# EAGLE schematic FSAE Dash v0.2 (EAGLE 7.7.0)

## Sheet 1 of 4
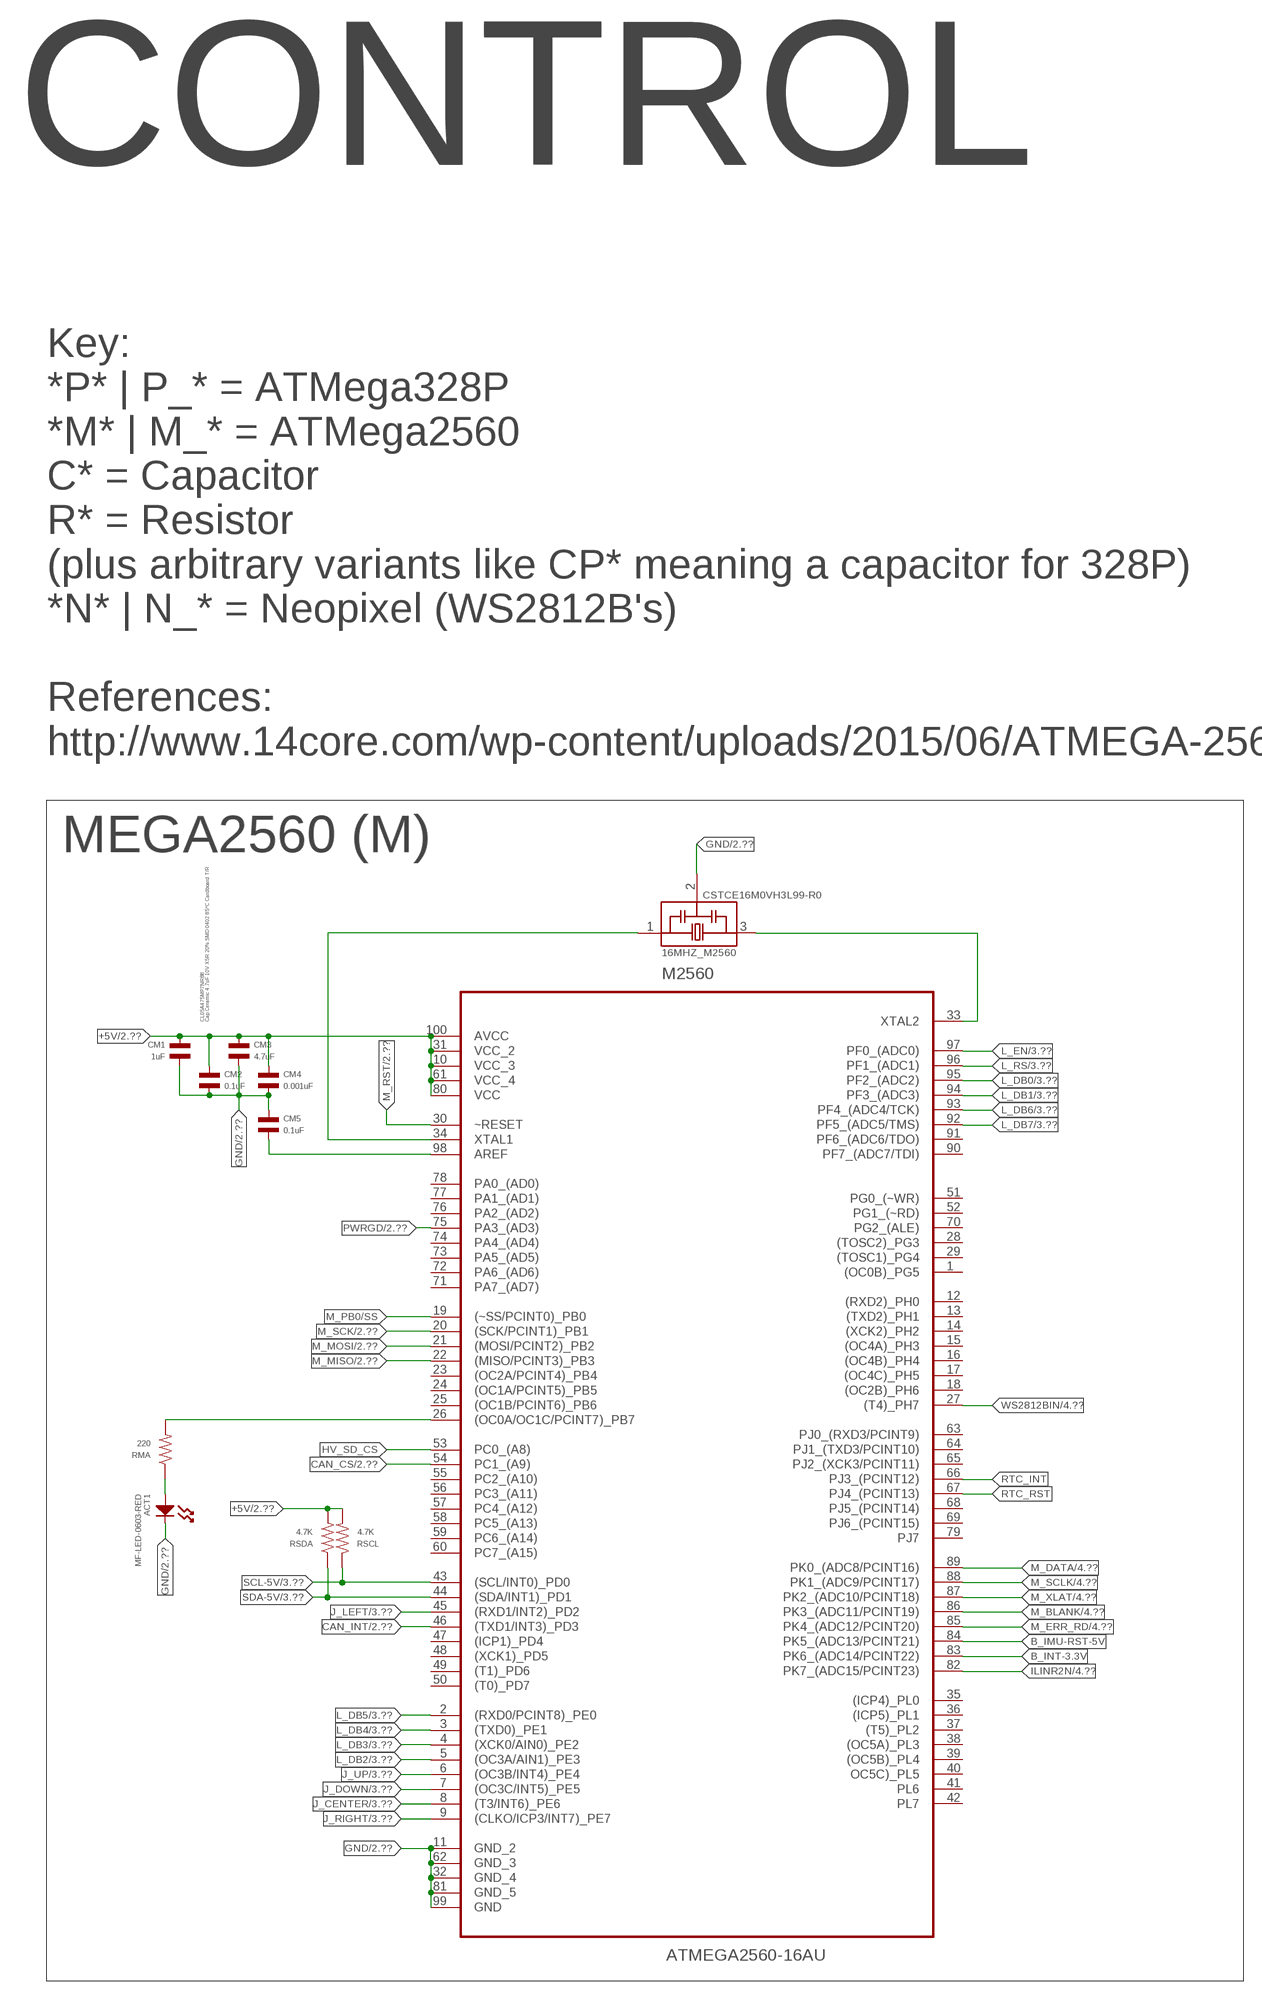
[diagram p0: schematic, sheet 1, part 1 of 2]
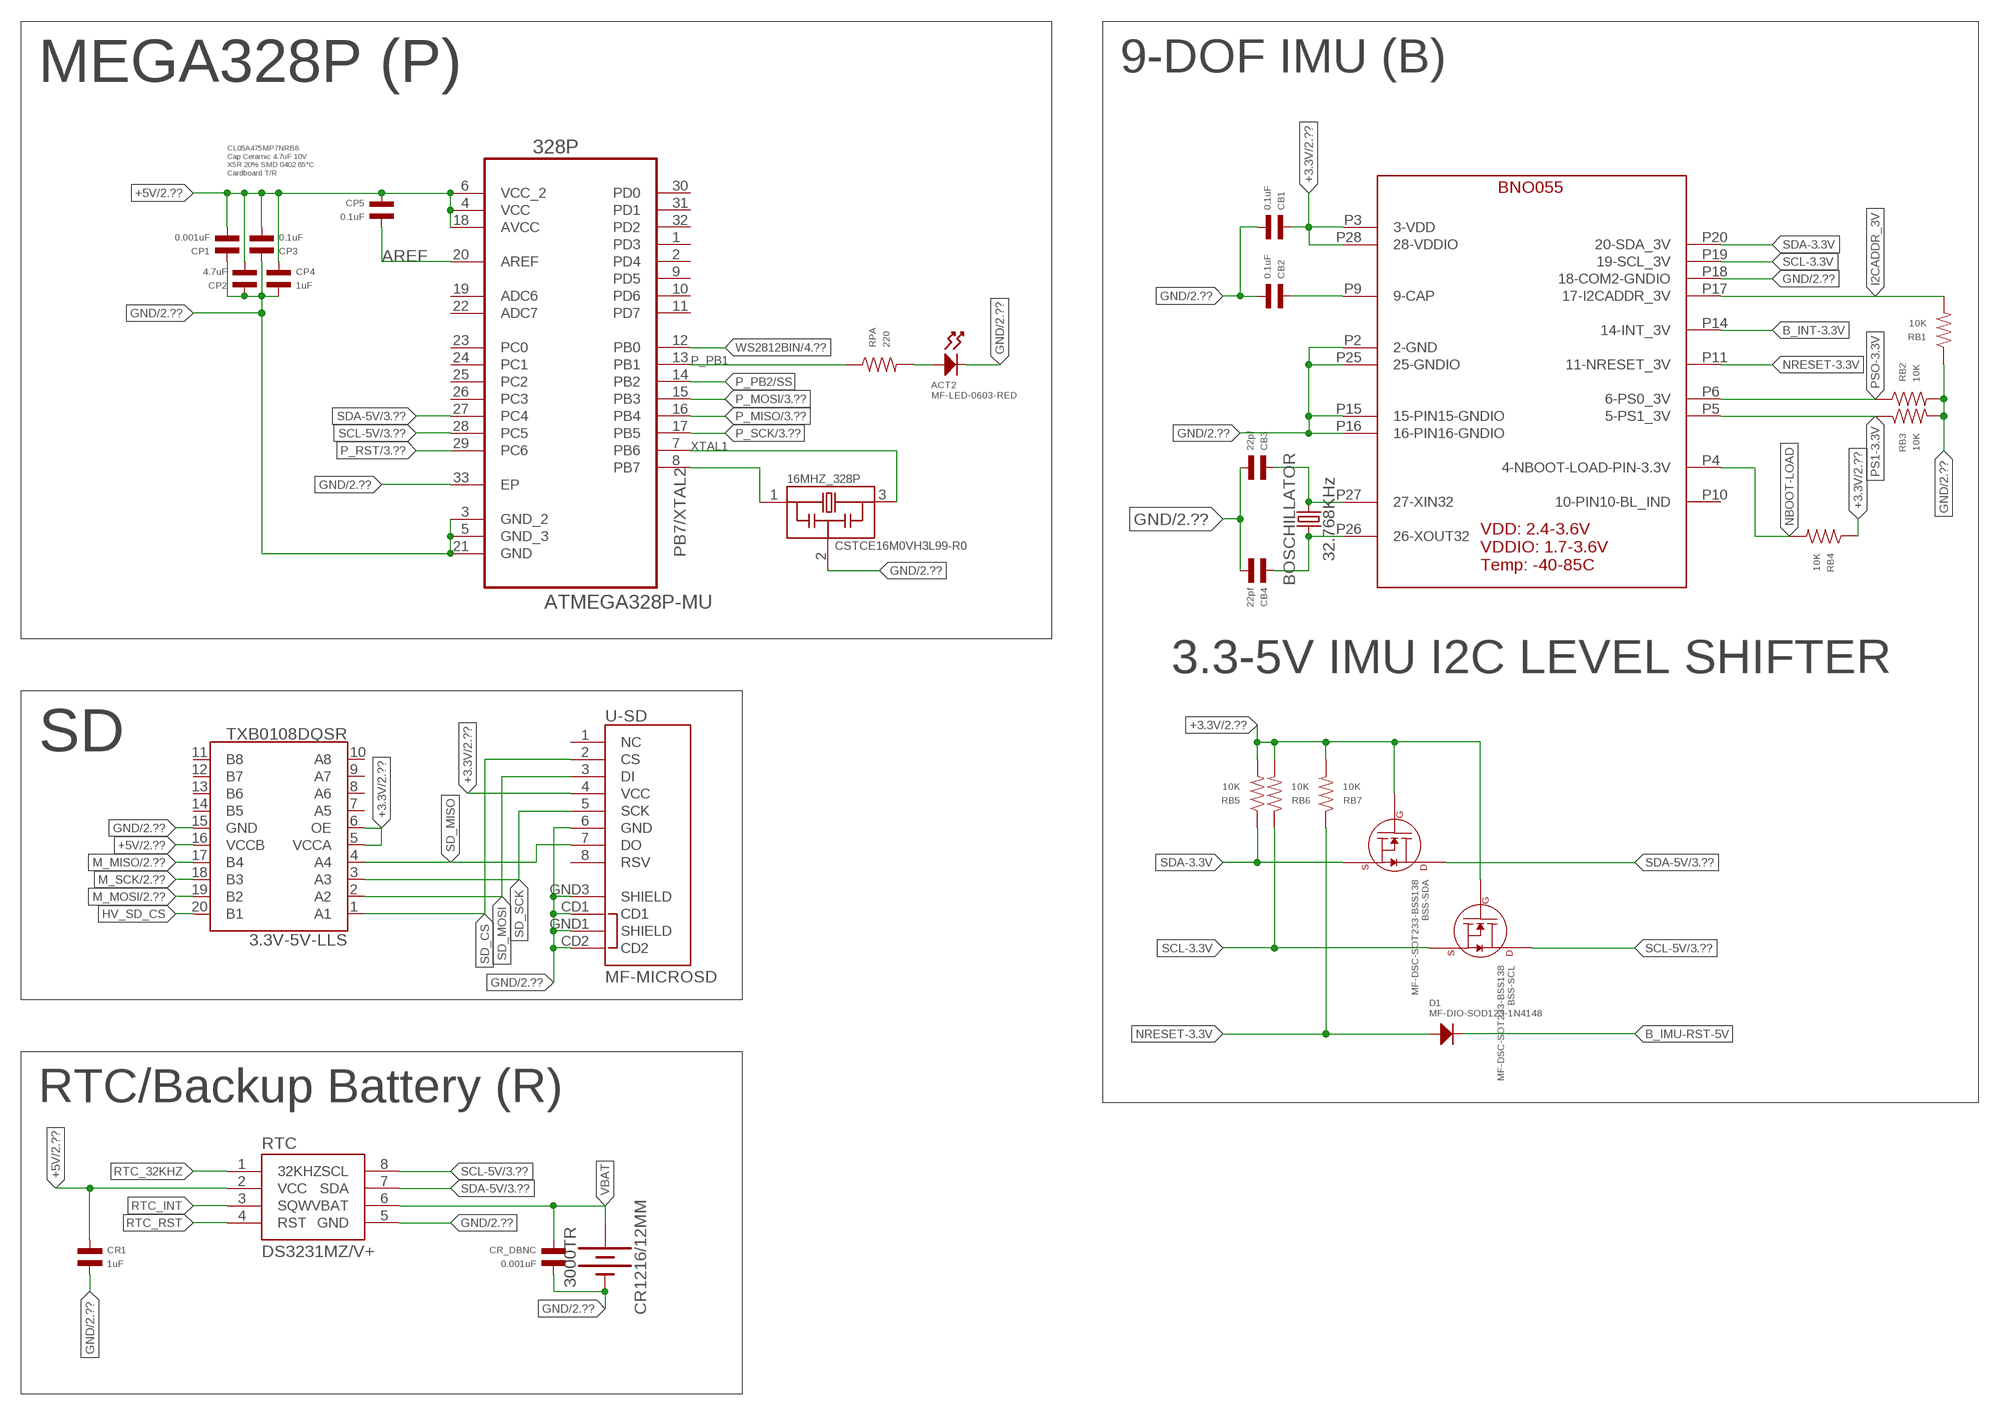
[diagram p1: schematic, sheet 1, part 2 of 2]

### Parts
3.3V-5V-LLS  TXB0108DQSR  TXB0108  [UFDFN-20]
16MHZ_328P  CSTCE16M0VH3L99-R0  CSTCE16M0V53-R0  [OSC_CSTCE16M0V53-R0]
16MHZ_M2560  CSTCE16M0VH3L99-R0  CSTCE16M0V53-R0  [OSC_CSTCE16M0V53-R0]
328P  ATMEGA328P-MU  [QFN50P500X500X100-33N]
ACT1  MF-LED-0603-RED  LED_SINGLE-0603-RED  [LED0603]
ACT2  MF-LED-0603-RED  LED_SINGLE-0603-RED  [LED0603]
BNO  BNO055  BOSCH-BNO055  [BOSCH-BNO055]
BOSCHILLATOR  32.768KHz  CRYSTALSMD-3.2X1.5  [CRYSTAL-SMD-3.2X1.5MM]
BSS-SCL  MF-DSC-SOT233-BSS138  N-CHANNEL_FET_BSS138_SOT-23-3  [SOT-23-3]
BSS-SDA  MF-DSC-SOT233-BSS138  N-CHANNEL_FET_BSS138_SOT-23-3  [SOT-23-3]
CB1  0.1uF  CAPACITOR_NP_0402  [C0402]
CB2  0.1uF  CAPACITOR_NP_0402  [C0402]
CB3  22pf  CAPACITOR_NP_0402  [C0402]
CB4  22pf  CAPACITOR_NP_0402  [C0402]
CM1  1uF  CAPACITOR_NP_0402  [C0402]
CM2  0.1uF  CAPACITOR_NP_0402  [C0402]
CM3  4.7uF  CAPACITOR_NP_0402  [C0402]
CM4  0.001uF  CAPACITOR_NP_0402  [C0402]
CM5  0.1uF  CAPACITOR_NP_0402  [C0402]
CP1  0.001uF  CAPACITOR_NP_0402  [C0402]
CP2  4.7uF  CAPACITOR_NP_0402  [C0402]
CP3  0.1uF  CAPACITOR_NP_0402  [C0402]
CP4  1uF  CAPACITOR_NP_0402  [C0402]
CP5  0.1uF  CAPACITOR_NP_0402  [C0402]
CR1  1uF  CAPACITOR_NP_0402  [C0402]
CR1216/12MM  3000TR  BATTERY-12MM_SMD  [BATTCON_12MM]
CR_DBNC  0.001uF  CAPACITOR_NP_0402  [C0402]
D1  MF-DIO-SOD123-1N4148  DIODES_1N4148_SOD-123  [SOD-123]
M2560  ATMEGA2560-16AU  [QFP50P1600X1600X120-100N]
RB1  10K  RESISTOR_0402  [R0402]
RB2  10K  RESISTOR_0402  [R0402]
RB3  10K  RESISTOR_0402  [R0402]
RB4  10K  RESISTOR_0402  [R0402]
RB5  10K  RESISTOR_0402  [R0402]
RB6  10K  RESISTOR_0402  [R0402]
RB7  10K  RESISTOR_0402  [R0402]
RMA  220  RESISTOR_0402  [R0402]
RPA  220  RESISTOR_0402  [R0402]
RSCL  4.7K  RESISTOR_0402  [R0402]
RSDA  4.7K  RESISTOR_0402  [R0402]
RTC  DS3231MZ/V+  DS3231M  [SO08]
U-SD  MF-MICROSD  USD-SOCKET  [MICROSD_1:1]

### Nets
+3.3V: 3.3V-5V-LLS.5(VCCA) 3.3V-5V-LLS.6(OE) BNO.P3(3-VDD) BNO.P28(28-VDDIO) BSS-SCL.P$1(GATE) BSS-SDA.P$1(GATE) CB1.P$1 RB4.P$1 RB5.P$2 RB6.P$2 RB7.P$2 U-SD.4(VCC) ; also sheet 2
+5V: 3.3V-5V-LLS.16(VCCB) 328P.4(VCC) 328P.6(VCC_2) 328P.18(AVCC) CM1.P$1 CM2.P$1 CM3.P$1 CM4.P$1 CP1.P$2 CP2.P$2 CP3.P$2 CP4.P$1 CP5.P$1 CR1.P$1 M2560.10(VCC_3) M2560.31(VCC_2) M2560.61(VCC_4) M2560.80(VCC) M2560.100(AVCC) RSCL.P$2 RSDA.P$2 RTC.2(VCC) ; also sheet 2,3,4
AREF: 328P.20(AREF) CP5.P$2
B_IMU-RST-5V: D1.CATHODE M2560.84(PK5_(ADC13/PCINT21))
B_INT-3.3V: BNO.P14(14-INT_3V) M2560.83(PK6_(ADC14/PCINT22))
BCAP: BNO.P9(9-CAP) CB2.P$1
CAN_CS: M2560.54(PC1_(A9)) ; also sheet 2
CAN_INT: M2560.46((TXD1/INT3)_PD3) ; also sheet 2
GND: 3.3V-5V-LLS.15(GND) 16MHZ_328P.2 16MHZ_M2560.2 328P.3(GND_2) 328P.5(GND_3) 328P.21(GND) 328P.33(EP) ACT1.CATHODE ACT2.CATHODE BNO.P2(2-GND) BNO.P15(15-PIN15-GNDIO) BNO.P16(16-PIN16-GNDIO) BNO.P18(18-COM2-GNDIO) BNO.P25(25-GNDIO) CB1.P$2 CB2.P$2 CB3.P$2 CB4.P$2 CM1.P$2 CM2.P$2 CM3.P$2 CM4.P$2 CM5.P$1 CP1.P$1 CP2.P$1 CP3.P$1 CP4.P$2 CR1.P$2 CR1216/12MM.GND(-) CR_DBNC.P$2 M2560.11(GND_2) M2560.32(GND_4) M2560.62(GND_3) M2560.81(GND_5) M2560.99(GND) RB1.P$1 RB2.P$2 RB3.P$2 RTC.5(GND) U-SD.6(GND) U-SD.CD1 U-SD.CD2 U-SD.GND1(SHIELD) U-SD.GND3(SHIELD) ; also sheet 2,3,4
HV_SD_CS [8mil]: 3.3V-5V-LLS.20(B1) M2560.53(PC0_(A8))
I2CADDR_3V: BNO.P17(17-I2CADDR_3V) RB1.P$2
ILINR2N: M2560.82(PK7_(ADC15/PCINT23)) ; also sheet 4
J_CENTER: M2560.8((T3/INT6)_PE6) ; also sheet 3
J_DOWN: M2560.7((OC3C/INT5)_PE5) ; also sheet 3
J_LEFT: M2560.45((RXD1/INT2)_PD2) ; also sheet 3
J_RIGHT: M2560.9((CLKO/ICP3/INT7)_PE7) ; also sheet 3
J_UP: M2560.6((OC3B/INT4)_PE4) ; also sheet 3
L_DB0: M2560.95(PF2_(ADC2)) ; also sheet 3
L_DB1: M2560.94(PF3_(ADC3)) ; also sheet 3
L_DB2: M2560.5((OC3A/AIN1)_PE3) ; also sheet 3
L_DB3: M2560.4((XCK0/AIN0)_PE2) ; also sheet 3
L_DB4: M2560.3((TXD0)_PE1) ; also sheet 3
L_DB5: M2560.2((RXD0/PCINT8)_PE0) ; also sheet 3
L_DB6: M2560.93(PF4_(ADC4/TCK)) ; also sheet 3
L_DB7: M2560.92(PF5_(ADC5/TMS)) ; also sheet 3
L_EN: M2560.97(PF0_(ADC0)) ; also sheet 3
L_RS: M2560.96(PF1_(ADC1)) ; also sheet 3
M_BLANK: M2560.86(PK3_(ADC11/PCINT19)) ; also sheet 4
M_DATA: M2560.89(PK0_(ADC8/PCINT16)) ; also sheet 4
M_ERR_RD: M2560.85(PK4_(ADC12/PCINT20)) ; also sheet 4
M_MISO [8mil]: 3.3V-5V-LLS.17(B4) M2560.22((MISO/PCINT3)_PB3) ; also sheet 2,3
M_MOSI [8mil]: 3.3V-5V-LLS.19(B2) M2560.21((MOSI/PCINT2)_PB2) ; also sheet 2,3
M_PB0/SS: M2560.19((~SS/PCINT0)_PB0)
M_RST: M2560.30(~RESET) ; also sheet 2,3
M_SCK [8mil]: 3.3V-5V-LLS.18(B3) M2560.20((SCK/PCINT1)_PB1) ; also sheet 2,3
M_SCLK: M2560.88(PK1_(ADC9/PCINT17)) ; also sheet 4
M_XLAT: M2560.87(PK2_(ADC10/PCINT18)) ; also sheet 4
N$21 [_12mil]: ACT2.ANODE RPA.P$2
N$23: 16MHZ_M2560.3 M2560.33(XTAL2)
N$26: CM5.P$2 M2560.98(AREF)
N$29: 16MHZ_M2560.1 M2560.34(XTAL1)
N$32: ACT1.ANODE RMA.P$1
N$34: BNO.P26(26-XOUT32) BOSCHILLATOR.P$1 CB4.P$1
N$35: BNO.P27(27-XIN32) BOSCHILLATOR.P$2 CB3.P$1
N$38: M2560.26((OC0A/OC1C/PCINT7)_PB7) RMA.P$2
NBOOT-LOAD: BNO.P4(4-NBOOT-LOAD-PIN-3.3V) RB4.P$2
NRESET-3.3V: BNO.P11(11-NRESET_3V) D1.ANODE RB7.P$1
P_MISO: 328P.16(PB4) ; also sheet 3
P_MOSI: 328P.15(PB3) ; also sheet 3
P_PB1: 328P.13(PB1) RPA.P$1
P_PB2/SS: 328P.14(PB2)
P_RST: 328P.29(PC6) ; also sheet 3
P_SCK: 328P.17(PB5) ; also sheet 3
PB7/XTAL2: 16MHZ_328P.1 328P.8(PB7)
PS1-3.3V: BNO.P5(5-PS1_3V) RB3.P$1
PSO-3.3V: BNO.P6(6-PS0_3V) RB2.P$1
PWRGD: M2560.75(PA3_(AD3)) ; also sheet 2
RTC_32KHZ: RTC.1(32KHZ)
RTC_INT: M2560.66(PJ3_(PCINT12)) RTC.3(SQW)
RTC_RST: M2560.67(PJ4_(PCINT13)) RTC.4(RST)
SCL-3.3V: BNO.P19(19-SCL_3V) BSS-SCL.P$2(SOURCE) RB6.P$1
SCL-5V: 328P.28(PC5) BSS-SCL.P$3(DRAIN) M2560.43((SCL/INT0)_PD0) RSCL.P$1 RTC.8(SCL) ; also sheet 3
SD_CS [8mil]: 3.3V-5V-LLS.1(A1) U-SD.2(CS)
SD_MISO: 3.3V-5V-LLS.4(A4) U-SD.7(DO)
SD_MOSI: 3.3V-5V-LLS.2(A2) U-SD.3(DI)
SD_SCK: 3.3V-5V-LLS.3(A3) U-SD.5(SCK)
SDA-3.3V: BNO.P20(20-SDA_3V) BSS-SDA.P$2(SOURCE) RB5.P$1
SDA-5V: 328P.27(PC4) BSS-SDA.P$3(DRAIN) M2560.44((SDA/INT1)_PD1) RSDA.P$1 RTC.7(SDA) ; also sheet 3
VBAT: CR1216/12MM.PWR@1(+) CR_DBNC.P$1 RTC.6(VBAT)
WS2812BIN: 328P.12(PB0) M2560.27((T4)_PH7) ; also sheet 4
XTAL1: 16MHZ_328P.3 328P.7(PB6)
Unconnected: 3.3V-5V-LLS.7(A5) 3.3V-5V-LLS.8(A6) 3.3V-5V-LLS.9(A7) 3.3V-5V-LLS.10(A8) 3.3V-5V-LLS.11(B8) 3.3V-5V-LLS.12(B7) 3.3V-5V-LLS.13(B6) 3.3V-5V-LLS.14(B5) 328P.1(PD3) 328P.2(PD4) 328P.9(PD5) 328P.10(PD6) 328P.11(PD7) 328P.19(ADC6) 328P.22(ADC7) 328P.23(PC0) 328P.24(PC1) 328P.25(PC2) 328P.26(PC3) 328P.30(PD0) 328P.31(PD1) 328P.32(PD2) BNO.P10(10-PIN10-BL_IND) M2560.1((OC0B)_PG5) M2560.12((RXD2)_PH0) M2560.13((TXD2)_PH1) M2560.14((XCK2)_PH2) M2560.15((OC4A)_PH3) M2560.16((OC4B)_PH4) M2560.17((OC4C)_PH5) M2560.18((OC2B)_PH6) M2560.23((OC2A/PCINT4)_PB4) M2560.24((OC1A/PCINT5)_PB5) M2560.25((OC1B/PCINT6)_PB6) M2560.28((TOSC2)_PG3) M2560.29((TOSC1)_PG4) M2560.35((ICP4)_PL0) M2560.36((ICP5)_PL1) M2560.37((T5)_PL2) M2560.38((OC5A)_PL3) M2560.39((OC5B)_PL4) M2560.40(OC5C)_PL5) M2560.41(PL6) M2560.42(PL7) M2560.47((ICP1)_PD4) M2560.48((XCK1)_PD5) M2560.49((T1)_PD6) M2560.50((T0)_PD7) M2560.51(PG0_(~WR)) M2560.52(PG1_(~RD)) M2560.55(PC2_(A10)) M2560.56(PC3_(A11)) M2560.57(PC4_(A12)) M2560.58(PC5_(A13)) M2560.59(PC6_(A14)) M2560.60(PC7_(A15)) M2560.63(PJ0_(RXD3/PCINT9)) M2560.64(PJ1_(TXD3/PCINT10)) M2560.65(PJ2_(XCK3/PCINT11)) M2560.68(PJ5_(PCINT14)) M2560.69(PJ6_(PCINT15)) M2560.70(PG2_(ALE)) M2560.71(PA7_(AD7)) M2560.72(PA6_(AD6)) M2560.73(PA5_(AD5)) M2560.74(PA4_(AD4)) M2560.76(PA2_(AD2)) M2560.77(PA1_(AD1)) M2560.78(PA0_(AD0)) M2560.79(PJ7) M2560.90(PF7_(ADC7/TDI)) M2560.91(PF6_(ADC6/TDO)) U-SD.1(NC) U-SD.8(RSV)

### Notes on the sheet
- CONTROL
- NOTES:
  The original boards were manufactured using MacroFab's standard 4-layer turnkey process. 
  If needed, my own library has been included.
  
  Objects beginning with "MF" are from the MacroFab Eagle library, available on Github, along with the relevant DRC.
  MacroFab has a relatively long lead time (~1mo) and occasionally makes mistakes, 
  so budget in some ChipQuik and don't procrastinate with orders. 
  MacroFab's system pulls model numbers from the Eagle "value" field, 
  so if you're not sure what something here is, see if there's not something in it.
  
  Special thanks to SparkFun and Adafruit OSHW designs, on which parts of this are based. 
  
  Also FYI: WS2812B's (the LED's) have an equivalent Moisture Sensitivity Level 6! 
  Using them in a reflow oven without using desiccants and baking them before use will lead to cracked epoxy lenses! 
  Resoldering them by hand was not fun. 
  (The next versions will use the newer variants with redundant data lines as an extra precaution.)
  
  Clinton Flowers, 2017-7-01
  clintonflowers222@gmail.com
  Kennesaw State University Motorsports
- Key:
  *P* | P_* = ATMega328P
  *M* | M_* = ATMega2560
  C* = Capacitor
  R* = Resistor
  (plus arbitrary variants like CP* meaning a capacitor for 328P)
  *N* | N_* = Neopixel (WS2812B's)
  
  References:
  http://www.14core.com/wp-content/uploads/2015/06/ATMEGA-2560-Pin-Out-Diagram.png
- MEGA2560 (M) | MEGA328P (P) | 9-DOF IMU (B)
- CL05A475MP7NRB8
  Cap Ceramic 4.7uF 10V 
  X5R 20% SMD 0402 85°C 
  Cardboard T/R
- CL05A475MP7NRB8
  Cap Ceramic 4.7uF 10V X5R 20% SMD 0402 85°C Cardboard T/R
- 3.3-5V IMU I2C LEVEL SHIFTER
- SD
- RTC/Backup Battery (R)

## Sheet 2 of 4
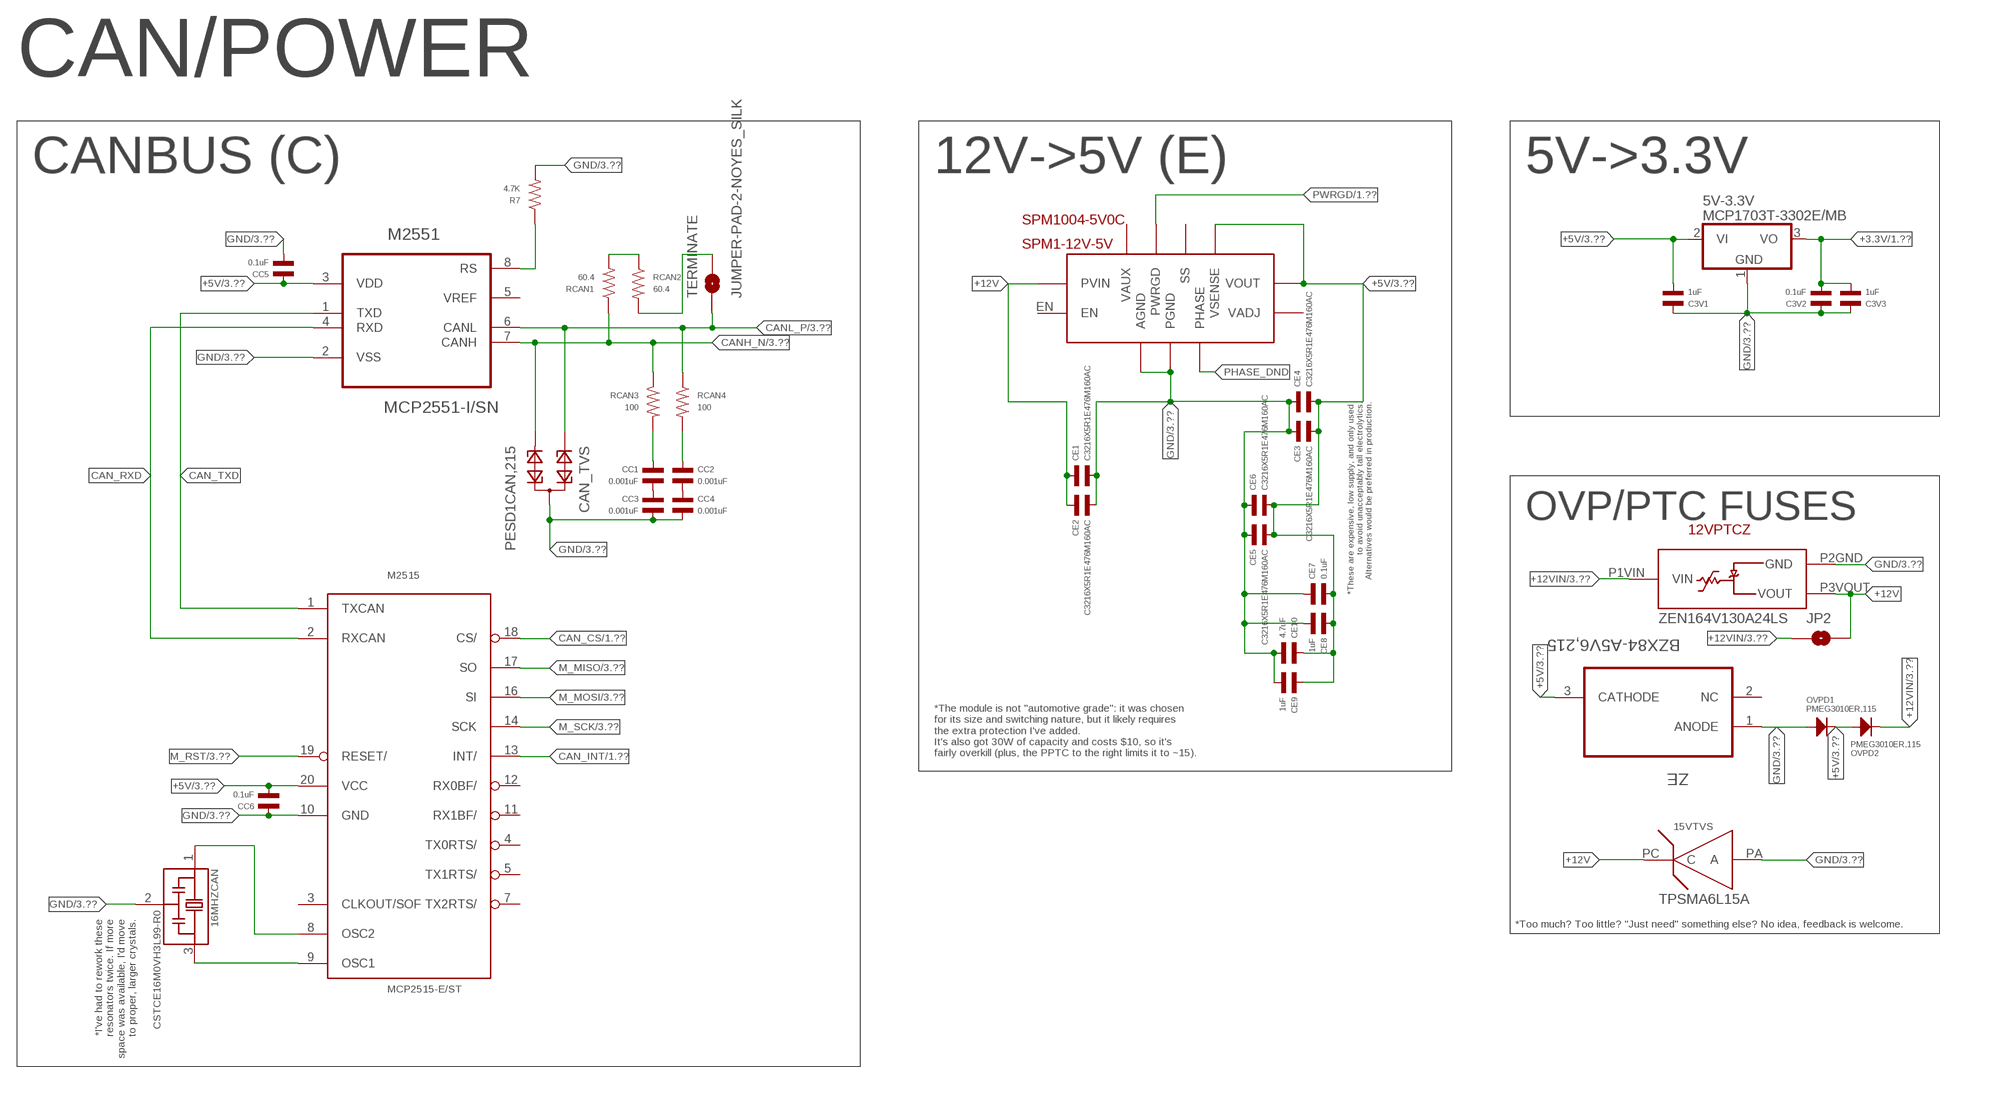
[diagram p2: schematic, sheet 2]

### Parts
5V-3.3V  MCP1703T-3302E/MB  MCP170333MB  [SOT89]
12VPTCZ  ZEN164V130A24LS  LITTELFUSE-POLYZEN-ZEN164V130A24LS  [LITTELFUSE-POLYZEN-ZEN164V130A24LS]
15VTVS  TPSMA6L15A  LITTELFUSE-TPSMA6L15A  [LITTELFUSE-TPSMA6L15A]
16MHZCAN  CSTCE16M0VH3L99-R0  CSTCE16M0V53-R0  [OSC_CSTCE16M0V53-R0]
C3V1  1uF  CAPACITOR_NP_0402  [C0402]
C3V2  0.1uF  CAPACITOR_NP_0402  [C0402]
C3V3  1uF  CAPACITOR_NP_0402  [C0402]
CAN_TVS  PESD1CAN,215  PESD1CAN  [SOT23]
CC1  0.001uF  CAPACITOR_NP_0402  [C0402]
CC2  0.001uF  CAPACITOR_NP_0402  [C0402]
CC3  0.001uF  CAPACITOR_NP_0402  [C0402]
CC4  0.001uF  CAPACITOR_NP_0402  [C0402]
CC5  0.1uF  CAPACITOR_NP_0402  [C0402]
CC6  0.1uF  CAPACITOR_NP_0402  [C0402]
CE1  C3216X5R1E476M160AC  CAPACITOR_NP_1206  [C1206]
CE2  C3216X5R1E476M160AC  CAPACITOR_NP_1206  [C1206]
CE3  C3216X5R1E476M160AC  CAPACITOR_NP_1206  [C1206]
CE4  C3216X5R1E476M160AC  CAPACITOR_NP_1206  [C1206]
CE5  C3216X5R1E476M160AC  CAPACITOR_NP_1206  [C1206]
CE6  C3216X5R1E476M160AC  CAPACITOR_NP_1206  [C1206]
CE7  0.1uF  CAPACITOR_NP_0402  [C0402]
CE8  1uF  CAPACITOR_NP_0402  [C0402]
CE9  1uF  CAPACITOR_NP_0402  [C0402]
CE10  4.7uF  CAPACITOR_NP_0402  [C0402]
JP2  JUMPER-SMT_2_NO_SILK  [SMT-JUMPER_2_NO_SILK]
M2515  MCP2515-E/ST  MCP2515TSOP  [TSSOP20]
M2551  MCP2551-I/SN  [SOIC127P600X175-8N]
OVPD1  PMEG3010ER,115  DIODES_SOD-123  [SOD-123]
OVPD2  PMEG3010ER,115  DIODES_SOD-123  [SOD-123]
R7  4.7K  RESISTOR_0402  [R0402]
RCAN1  60.4  RESISTOR_0402  [R0402]
RCAN2  60.4  RESISTOR_0402  [R0402]
RCAN3  100  RESISTOR_0402  [R0402]
RCAN4  100  RESISTOR_0402  [R0402]
SPM1-12V-5V  SPM1004-5V0C  [SPM1004-5V0C]
TERMINATE  JUMPER-PAD-2-NOYES_SILK  [PAD-JUMPER-2-NO_YES_SILK]
ZE  BZX84-A5V6,215  BZX84C5V6  [SOT91P240X110-3N]

### Nets
+3.3V: 5V-3.3V.3(VO) C3V2.P$2 C3V3.P$2 ; also sheet 1
+5V: 5V-3.3V.2(VI) 5V-3.3V.2@1(VI1) C3V1.P$2 CC5.P$1 CC6.P$2 CE3.P$2 CE4.P$2 CE5.P$2 CE6.P$2 CE7.P$2 CE8.P$1 CE9.P$1 CE10.P$1 M2515.20(VCC) M2551.3(VDD) OVPD1.CATHODE OVPD2.ANODE SPM1-12V-5V.VOUT$1(VOUT) SPM1-12V-5V.VOUT$2(VOUT) SPM1-12V-5V.VOUT$3(VOUT) SPM1-12V-5V.VOUT$4(VOUT) SPM1-12V-5V.VOUT$5(VOUT) SPM1-12V-5V.VOUT$6(VOUT) SPM1-12V-5V.VOUT$7(VOUT) SPM1-12V-5V.VOUT$8(VOUT) SPM1-12V-5V.VOUT$9(VOUT) SPM1-12V-5V.VOUT$10(VOUT) SPM1-12V-5V.VOUT$11(VOUT) SPM1-12V-5V.VOUT$12(VOUT) SPM1-12V-5V.VOUT$13(VOUT) SPM1-12V-5V.VOUT$14(VOUT) SPM1-12V-5V.VOUT$15(VOUT) SPM1-12V-5V.VOUT$16(VOUT) SPM1-12V-5V.VOUT$17(VOUT) SPM1-12V-5V.VOUT$18(VOUT) SPM1-12V-5V.VSENSE ZE.3(CATHODE) ; also sheet 1,3,4
+12V [_25mil]: 12VPTCZ.P3VOUT(VOUT) 15VTVS.PC(C) CE1.P$1 CE2.P$1 JP2.2 SPM1-12V-5V.PVIN$1(PVIN) SPM1-12V-5V.PVIN$2(PVIN) SPM1-12V-5V.PVIN$3(PVIN) SPM1-12V-5V.PVIN$4(PVIN) SPM1-12V-5V.PVIN$5(PVIN) SPM1-12V-5V.PVIN$6(PVIN) SPM1-12V-5V.PVIN$7(PVIN) SPM1-12V-5V.PVIN$8(PVIN)
+12VIN [_25mil]: 12VPTCZ.P1VIN(VIN) JP2.1 OVPD2.CATHODE ; also sheet 3
CAN_CS: M2515.18(CS/) ; also sheet 1
CAN_INT: M2515.13(INT/) ; also sheet 1
CAN_RXD: M2515.2(RXCAN) M2551.4(RXD)
CAN_TXD: M2515.1(TXCAN) M2551.1(TXD)
CANH_N [8mil]: CAN_TVS.2 M2551.7(CANH) RCAN1.P$1 RCAN3.P$1 ; also sheet 3
CANL_P [8mil]: CAN_TVS.1 M2551.6(CANL) RCAN4.P$1 TERMINATE.1 ; also sheet 3
GND: 5V-3.3V.1(GND) 12VPTCZ.P2GND(GND) 15VTVS.PA(A) 16MHZCAN.2 C3V1.P$1 C3V2.P$1 C3V3.P$1 CAN_TVS.3 CC3.P$2 CC4.P$2 CC5.P$2 CC6.P$1 CE1.P$2 CE2.P$2 CE3.P$1 CE4.P$1 CE5.P$1 CE6.P$1 CE7.P$1 CE8.P$2 CE9.P$2 CE10.P$2 M2515.10(GND) M2551.2(VSS) OVPD1.ANODE R7.P$2 SPM1-12V-5V.AGND$1(AGND) SPM1-12V-5V.AGND$2(AGND) SPM1-12V-5V.AGND$3(AGND) SPM1-12V-5V.PGND$1(PGND) SPM1-12V-5V.PGND$2(PGND) SPM1-12V-5V.PGND$3(PGND) SPM1-12V-5V.PGND$4(PGND) SPM1-12V-5V.PGND$5(PGND) SPM1-12V-5V.PGND$6(PGND) SPM1-12V-5V.PGND$7(PGND) SPM1-12V-5V.PGND$8(PGND) SPM1-12V-5V.PGND$9(PGND) SPM1-12V-5V.PGND$10(PGND) SPM1-12V-5V.PGND$11(PGND) SPM1-12V-5V.PGND$12(PGND) SPM1-12V-5V.PGND$13(PGND) SPM1-12V-5V.PGND$14(PGND) SPM1-12V-5V.PGND$15(PGND) SPM1-12V-5V.PGND$16(PGND) SPM1-12V-5V.PGND$17(PGND) SPM1-12V-5V.PGND$18(PGND) SPM1-12V-5V.PGND$19(PGND) SPM1-12V-5V.PGND$20(PGND) SPM1-12V-5V.PGND$21(PGND) SPM1-12V-5V.PGND$22(PGND) SPM1-12V-5V.PGND$23(PGND) SPM1-12V-5V.PGND$24(PGND) SPM1-12V-5V.PGND$25(PGND) SPM1-12V-5V.PGND$26(PGND) SPM1-12V-5V.PGND$27(PGND) SPM1-12V-5V.PGND$28(PGND) SPM1-12V-5V.PGND$29(PGND) SPM1-12V-5V.PGND$30(PGND) SPM1-12V-5V.PGND$31(PGND) SPM1-12V-5V.PGND$32(PGND) SPM1-12V-5V.PGND$33(PGND) SPM1-12V-5V.PGND$34(PGND) ZE.1(ANODE) ; also sheet 1,3,4
M_MISO [8mil]: M2515.17(SO) ; also sheet 1,3
M_MOSI [8mil]: M2515.16(SI) ; also sheet 1,3
M_RST: M2515.19(RESET/) ; also sheet 1,3
M_SCK [8mil]: M2515.14(SCK) ; also sheet 1,3
N$10: CC2.P$2 CC4.P$1
N$24: CC1.P$2 CC3.P$1
N$25: M2551.8(RS) R7.P$1
N$27: 16MHZCAN.1 M2515.8(OSC2)
N$28: 16MHZCAN.3 M2515.9(OSC1)
N$39: RCAN1.P$2 RCAN2.P$1
N$42: CC1.P$1 RCAN3.P$2
N$43: CC2.P$1 RCAN4.P$2
N$95: RCAN2.P$2 TERMINATE.2
PHASE_DND: SPM1-12V-5V.PHASE$1(PHASE) SPM1-12V-5V.PHASE$2(PHASE) SPM1-12V-5V.PHASE$3(PHASE)
PWRGD: SPM1-12V-5V.PWRGD ; also sheet 1
Unconnected: M2515.3(CLKOUT/SOF) M2515.4(TX0RTS/) M2515.5(TX1RTS/) M2515.7(TX2RTS/) M2515.11(RX1BF/) M2515.12(RX0BF/) M2551.5(VREF) SPM1-12V-5V.EN SPM1-12V-5V.SS SPM1-12V-5V.VADJ SPM1-12V-5V.VAUX$1(VAUX) SPM1-12V-5V.VAUX$2(VAUX) ZE.2(NC)

### Notes on the sheet
- CAN/POWER
- CANBUS (C) | 12V->5V (E) | 5V->3.3V
- *These are expensive, low supply, and only used 
  to avoid unacceptably tall electrolytics.
  Alternatives would be preferred in production.
- OVP/PTC FUSES
- ZEN164V130A24LS
- *The module is not "automotive grade": it was chosen
  for its size and switching nature, but it likely requires
  the extra protection I've added.
  It's also got 30W of capacity and costs $10, so it's
  fairly overkill (plus, the PPTC to the right limits it to ~15).
- TPSMA6L15A
- *I've had to rework these
  resonators twice. If more
  space was available, I'd move
  to proper, larger crystals.
- *Too much? Too little? "Just need" something else? No idea, feedback is welcome.

## Sheet 3 of 4
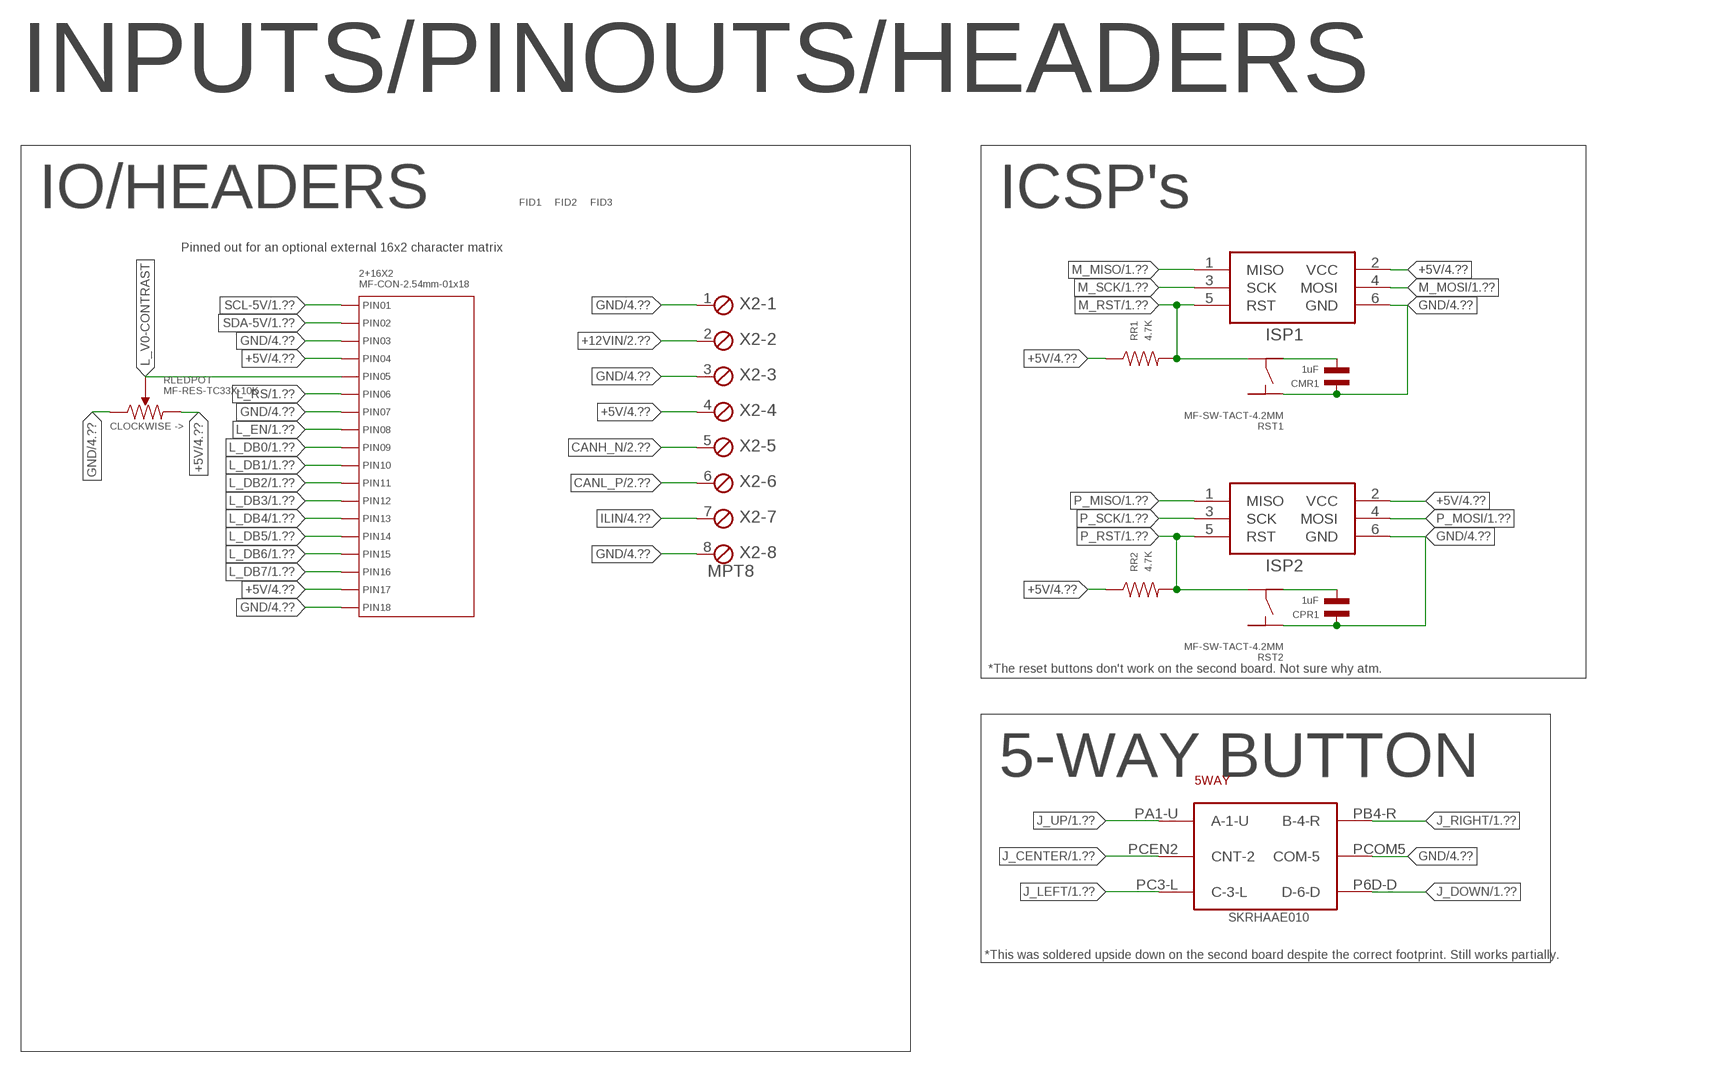
[diagram p3: schematic, sheet 3]

### Parts
2+16X2  MF-CON-2.54mm-01x18  CON_01X18_PTH_2.54MM  [PTH_2.54MM_01X18]
5WAY  SKRHAAE010  ALPS-SKRHAAE010  [ALPS-SKRHAAE010]
CMR1  1uF  CAPACITOR_NP_0402  [C0402]
CPR1  1uF  CAPACITOR_NP_0402  [C0402]
FID1  FIDUCIAL_100MIL  [FIDUCIAL_100MIL]
FID2  FIDUCIAL_100MIL  [FIDUCIAL_100MIL]
FID3  FIDUCIAL_100MIL  [FIDUCIAL_100MIL]
ISP1  AVRISP-6  [AVRISP]
ISP2  AVRISP-6  [AVRISP]
RLEDPOT  MF-RES-TC33X-10K  POTENTIOMETER_10K_TC33  [TC33]
RR1  4.7K  RESISTOR_0603  [R0603]
RR2  4.7K  RESISTOR_0603  [R0603]
RST1  MF-SW-TACT-4.2MM  TACT_4.2MM  [TACT4.2MM]
RST2  MF-SW-TACT-4.2MM  TACT_4.2MM  [TACT4.2MM]
X2  MPT8  [8POL254]

### Nets
+5V: 2+16X2.P$4(PIN4) 2+16X2.P$17(PIN17) ISP1.2(VCC) ISP2.2(VCC) RLEDPOT.P$3 RR1.P$1 RR2.P$1 X2.4 ; also sheet 1,2,4
+12VIN [_25mil]: X2.2 ; also sheet 2
CANH_N [8mil]: X2.5 ; also sheet 2
CANL_P [8mil]: X2.6 ; also sheet 2
GND: 2+16X2.P$3(PIN3) 2+16X2.P$7(PIN7) 2+16X2.P$18(PIN18) 5WAY.PCOM5(COM-5) CMR1.P$1 CPR1.P$1 ISP1.6(GND) ISP2.6(GND) RLEDPOT.P$1 RST1.P$1 RST2.P$1 X2.1 X2.3 X2.8 ; also sheet 1,2,4
ILIN: X2.7 ; also sheet 4
J_CENTER: 5WAY.PCEN2(CNT-2) ; also sheet 1
J_DOWN: 5WAY.P6D-D(D-6-D) ; also sheet 1
J_LEFT: 5WAY.PC3-L(C-3-L) ; also sheet 1
J_RIGHT: 5WAY.PB4-R(B-4-R) ; also sheet 1
J_UP: 5WAY.PA1-U(A-1-U) ; also sheet 1
L_DB0: 2+16X2.P$9(PIN9) ; also sheet 1
L_DB1: 2+16X2.P$10(PIN10) ; also sheet 1
L_DB2: 2+16X2.P$11(PIN11) ; also sheet 1
L_DB3: 2+16X2.P$12(PIN12) ; also sheet 1
L_DB4: 2+16X2.P$13(PIN13) ; also sheet 1
L_DB5: 2+16X2.P$14(PIN14) ; also sheet 1
L_DB6: 2+16X2.P$15(PIN15) ; also sheet 1
L_DB7: 2+16X2.P$16(PIN16) ; also sheet 1
L_EN: 2+16X2.P$8(PIN8) ; also sheet 1
L_RS: 2+16X2.P$6(PIN6) ; also sheet 1
L_V0-CONTRAST: 2+16X2.P$5(PIN5) RLEDPOT.P$2
M_MISO [8mil]: ISP1.1(MISO) ; also sheet 1,2
M_MOSI [8mil]: ISP1.4(MOSI) ; also sheet 1,2
M_RST: ISP1.5(RST) RR1.P$2 RST1.P$4 ; also sheet 1,2
M_SCK [8mil]: ISP1.3(SCK) ; also sheet 1,2
N$31: CPR1.P$2 RST2.P$3
N$33: CMR1.P$2 RST1.P$3
P_MISO: ISP2.1(MISO) ; also sheet 1
P_MOSI: ISP2.4(MOSI) ; also sheet 1
P_RST: ISP2.5(RST) RR2.P$2 RST2.P$4 ; also sheet 1
P_SCK: ISP2.3(SCK) ; also sheet 1
SCL-5V: 2+16X2.P$1(PIN1) ; also sheet 1
SDA-5V: 2+16X2.P$2(PIN2) ; also sheet 1
Unconnected: RST1.P$2 RST2.P$2

### Notes on the sheet
- INPUTS/PINOUTS/HEADERS
- IO/HEADERS | ICSP's
- Pinned out for an optional external 16x2 character matrix
- *The reset buttons don't work on the second board. Not sure why atm.
- 5-WAY BUTTON
- SKRHAAE010
- *This was soldered upside down on the second board despite the correct footprint. Still works partially.

## Sheet 4 of 4
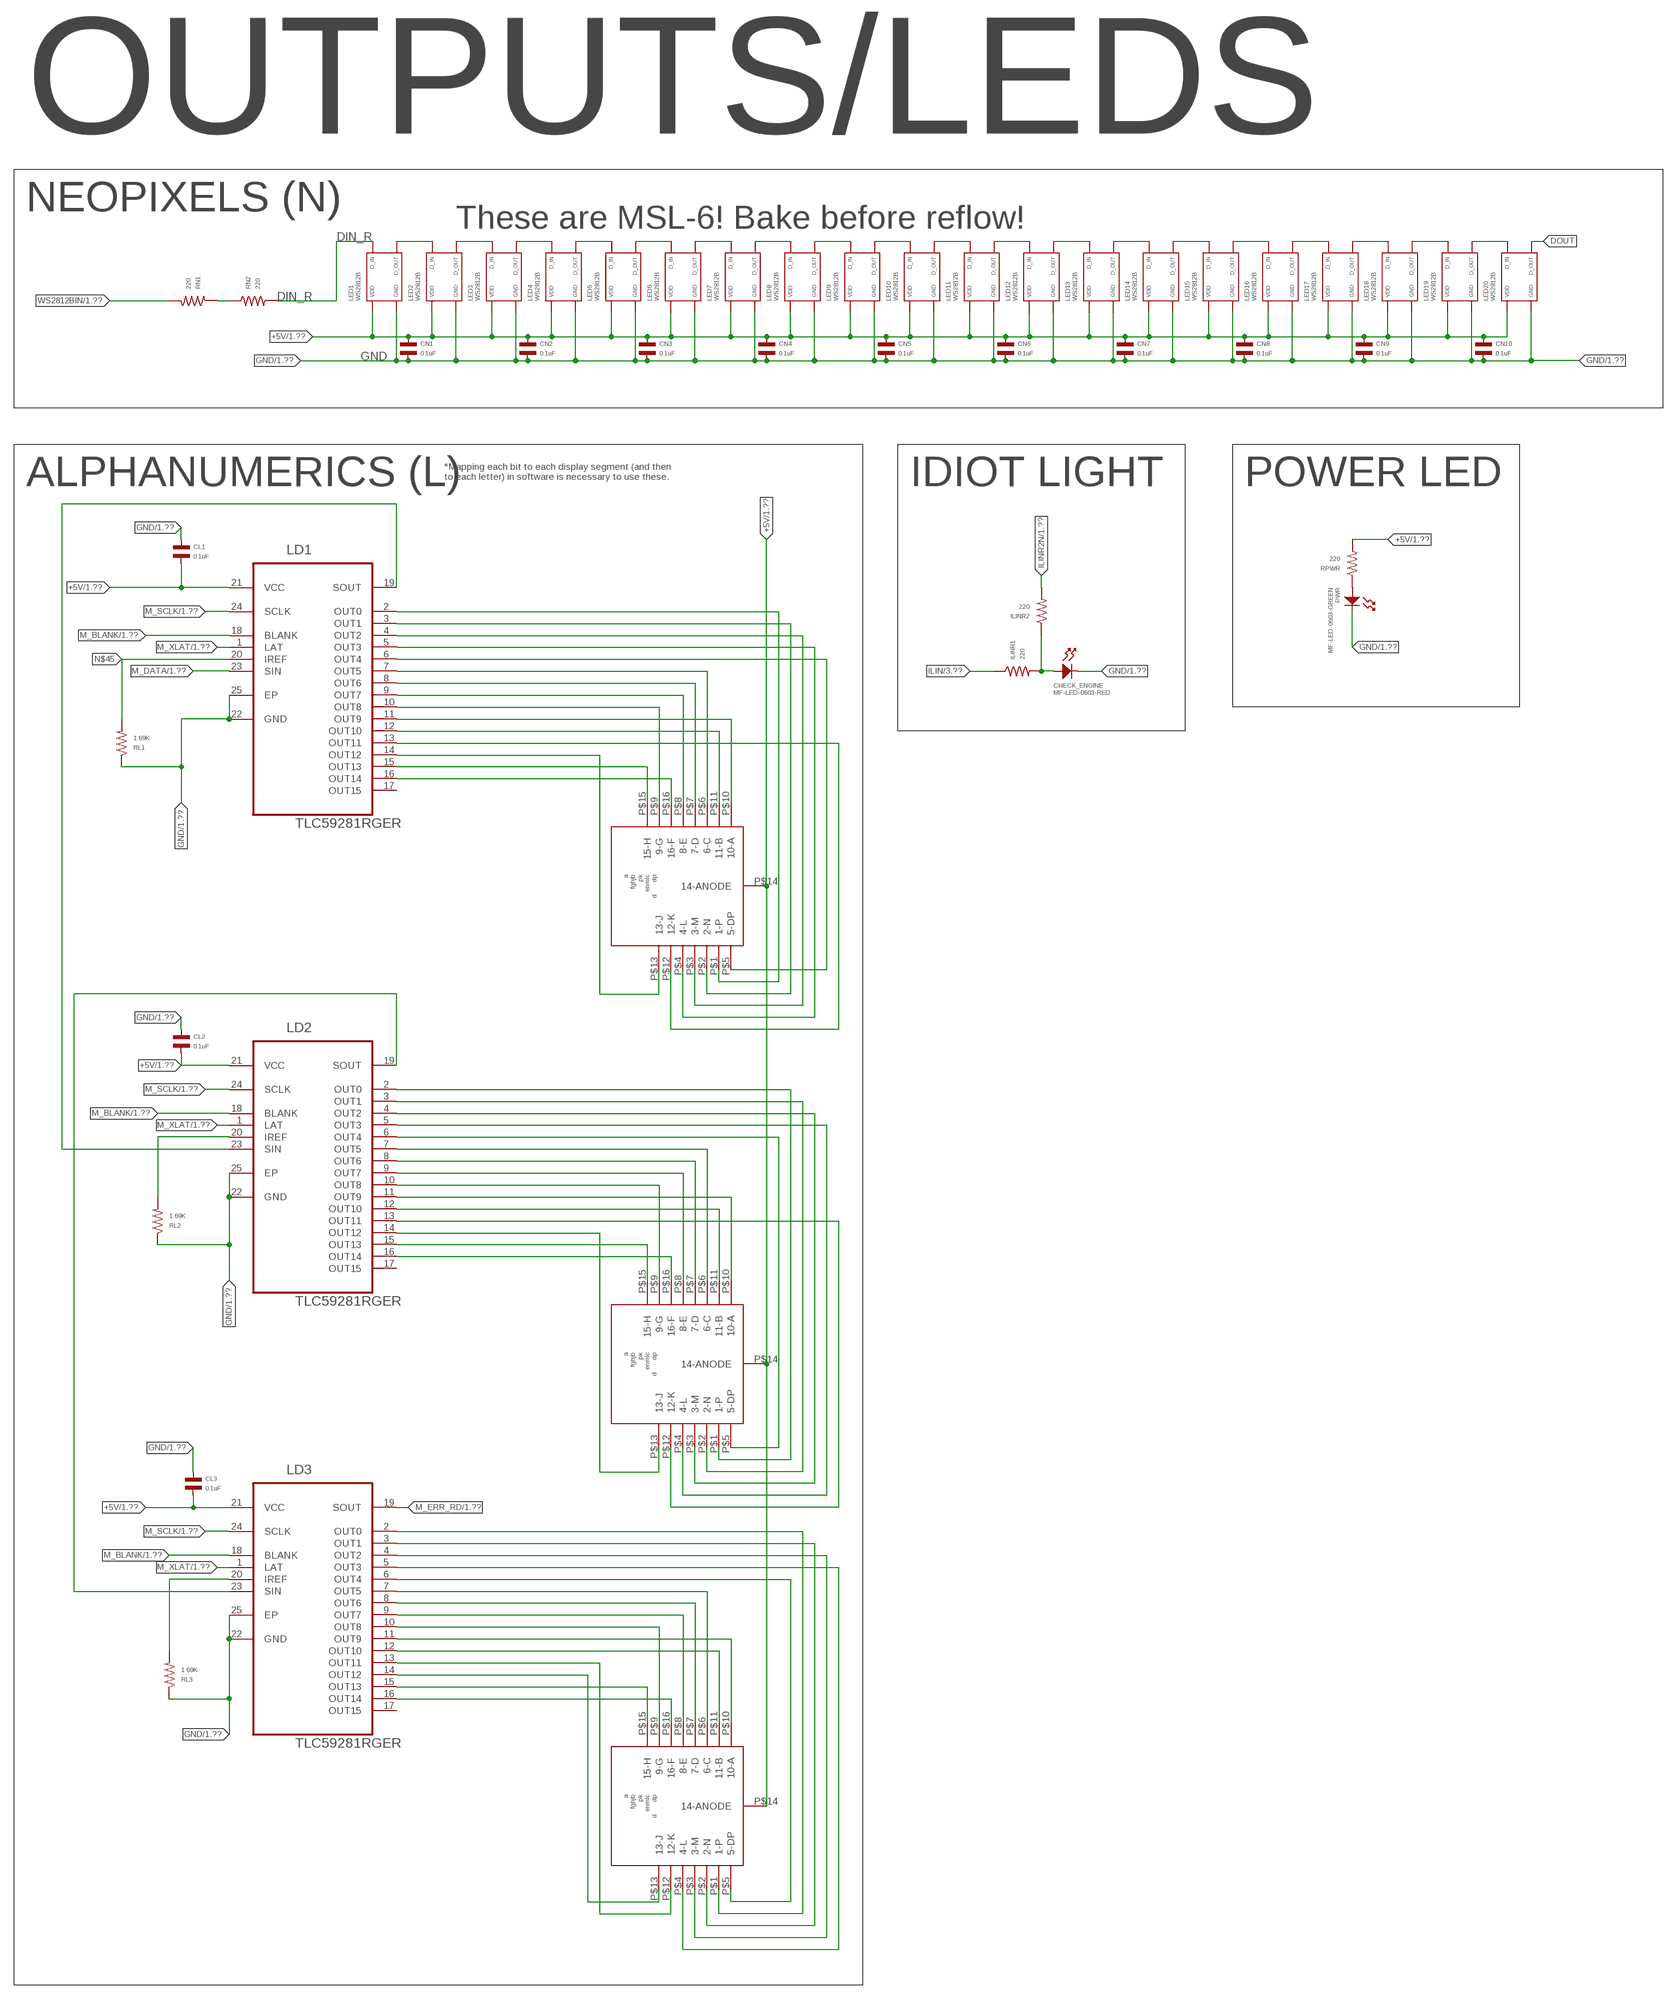
[diagram p4: schematic, sheet 4]

### Parts
CHECK_ENGINE  MF-LED-0603-RED  LED_SINGLE-0603-RED  [LED0603]
CL1  0.1uF  CAPACITOR_NP_0402  [C0402]
CL2  0.1uF  CAPACITOR_NP_0402  [C0402]
CL3  0.1uF  CAPACITOR_NP_0402  [C0402]
CN1  0.1uF  CAPACITOR_NP_0402  [C0402]
CN2  0.1uF  CAPACITOR_NP_0402  [C0402]
CN3  0.1uF  CAPACITOR_NP_0402  [C0402]
CN4  0.1uF  CAPACITOR_NP_0402  [C0402]
CN5  0.1uF  CAPACITOR_NP_0402  [C0402]
CN6  0.1uF  CAPACITOR_NP_0402  [C0402]
CN7  0.1uF  CAPACITOR_NP_0402  [C0402]
CN8  0.1uF  CAPACITOR_NP_0402  [C0402]
CN9  0.1uF  CAPACITOR_NP_0402  [C0402]
CN10  0.1uF  CAPACITOR_NP_0402  [C0402]
ILINR1  220  RESISTOR_0402  [R0402]
ILINR2  220  RESISTOR_0402  [R0402]
L1  ACPSA04-41SYKWA  [ACPSA04-41SYKWA]
L2  ACPSA04-41SYKWA  [ACPSA04-41SYKWA]
L3  ACPSA04-41SYKWA  [ACPSA04-41SYKWA]
LD1  TLC59281RGER  [QFN50P400X400X100-25N]
LD2  TLC59281RGER  [QFN50P400X400X100-25N]
LD3  TLC59281RGER  [QFN50P400X400X100-25N]
LED1  WS2812B  [WS2812B]
LED2  WS2812B  [WS2812B]
LED3  WS2812B  [WS2812B]
LED4  WS2812B  [WS2812B]
LED5  WS2812B  [WS2812B]
LED6  WS2812B  [WS2812B]
LED7  WS2812B  [WS2812B]
LED8  WS2812B  [WS2812B]
LED9  WS2812B  [WS2812B]
LED10  WS2812B  [WS2812B]
LED11  WS2812B  [WS2812B]
LED12  WS2812B  [WS2812B]
LED13  WS2812B  [WS2812B]
LED14  WS2812B  [WS2812B]
LED15  WS2812B  [WS2812B]
LED16  WS2812B  [WS2812B]
LED17  WS2812B  [WS2812B]
LED18  WS2812B  [WS2812B]
LED19  WS2812B  [WS2812B]
LED20  WS2812B  [WS2812B]
PWR  MF-LED-0603-GREEN  LED_SINGLE-0603-GREEN  [LED0603]
RL1  1.69K  RESISTOR_0603  [R0603]
RL2  1.69K  RESISTOR_0603  [R0603]
RL3  1.69K  RESISTOR_0603  [R0603]
RN1  220  RESISTOR_0402  [R0402]
RN2  220  RESISTOR_0402  [R0402]
RPWR  220  RESISTOR_0402  [R0402]

### Nets
+5V: CL1.P$2 CL2.P$2 CL3.P$2 CN1.P$1 CN2.P$1 CN3.P$1 CN4.P$1 CN5.P$1 CN6.P$1 CN7.P$1 CN8.P$1 CN9.P$1 CN10.P$1 L1.P$14(14-ANODE) L2.P$14(14-ANODE) L3.P$14(14-ANODE) LD1.21(VCC) LD2.21(VCC) LD3.21(VCC) LED1.P$1(VDD) LED2.P$1(VDD) LED3.P$1(VDD) LED4.P$1(VDD) LED5.P$1(VDD) LED6.P$1(VDD) LED7.P$1(VDD) LED8.P$1(VDD) LED9.P$1(VDD) LED10.P$1(VDD) LED11.P$1(VDD) LED12.P$1(VDD) LED13.P$1(VDD) LED14.P$1(VDD) LED15.P$1(VDD) LED16.P$1(VDD) LED17.P$1(VDD) LED18.P$1(VDD) LED19.P$1(VDD) LED20.P$1(VDD) RPWR.P$2 ; also sheet 1,2,3
DIN_R: LED1.P$4(DIN) RN2.P$2
DOUT: LED20.P$2(DOUT)
GND: CHECK_ENGINE.CATHODE CL1.P$1 CL2.P$1 CL3.P$1 CN1.P$2 CN2.P$2 CN3.P$2 CN4.P$2 CN5.P$2 CN6.P$2 CN7.P$2 CN8.P$2 CN9.P$2 CN10.P$2 LD1.22(GND) LD1.25(EP) LD2.22(GND) LD2.25(EP) LD3.22(GND) LD3.25(EP) LED1.P$3(VSS) LED2.P$3(VSS) LED3.P$3(VSS) LED4.P$3(VSS) LED5.P$3(VSS) LED6.P$3(VSS) LED7.P$3(VSS) LED8.P$3(VSS) LED9.P$3(VSS) LED10.P$3(VSS) LED11.P$3(VSS) LED12.P$3(VSS) LED13.P$3(VSS) LED14.P$3(VSS) LED15.P$3(VSS) LED16.P$3(VSS) LED17.P$3(VSS) LED18.P$3(VSS) LED19.P$3(VSS) LED20.P$3(VSS) PWR.CATHODE RL1.P$1 RL2.P$1 RL3.P$1 ; also sheet 1,2,3
ILIN: ILINR1.P$1 ; also sheet 3
ILINR2N: ILINR2.P$2 ; also sheet 1
M_BLANK: LD1.18(BLANK) LD2.18(BLANK) LD3.18(BLANK) ; also sheet 1
M_DATA: LD1.23(SIN) ; also sheet 1
M_ERR_RD: LD3.19(SOUT) ; also sheet 1
M_SCLK: LD1.24(SCLK) LD2.24(SCLK) LD3.24(SCLK) ; also sheet 1
M_XLAT: LD1.1(LAT) LD2.1(LAT) LD3.1(LAT) ; also sheet 1
N$1: LED1.P$2(DOUT) LED2.P$4(DIN)
N$2: LED2.P$2(DOUT) LED3.P$4(DIN)
N$3: LED3.P$2(DOUT) LED4.P$4(DIN)
N$4: LED4.P$2(DOUT) LED5.P$4(DIN)
N$5: LED5.P$2(DOUT) LED6.P$4(DIN)
N$6: LED6.P$2(DOUT) LED7.P$4(DIN)
N$7: LED7.P$2(DOUT) LED8.P$4(DIN)
N$8: PWR.ANODE RPWR.P$1
N$9: LED8.P$2(DOUT) LED9.P$4(DIN)
N$11: LED9.P$2(DOUT) LED10.P$4(DIN)
N$12: LED10.P$2(DOUT) LED11.P$4(DIN)
N$13: LED11.P$2(DOUT) LED12.P$4(DIN)
N$14: LED12.P$2(DOUT) LED13.P$4(DIN)
N$15: LED13.P$2(DOUT) LED14.P$4(DIN)
N$16: LED14.P$2(DOUT) LED15.P$4(DIN)
N$17: LED15.P$2(DOUT) LED16.P$4(DIN)
N$18: LED16.P$2(DOUT) LED17.P$4(DIN)
N$19: LED17.P$2(DOUT) LED18.P$4(DIN)
N$20: LED18.P$2(DOUT) LED19.P$4(DIN)
N$22: LED19.P$2(DOUT) LED20.P$4(DIN)
N$41: CHECK_ENGINE.ANODE ILINR1.P$2 ILINR2.P$1
N$44: RN1.P$1 RN2.P$1
N$45: LD1.20(IREF) RL1.P$2
N$46: LD1.19(SOUT) LD2.23(SIN)
N$47: L3.P$1(1-P) LD3.2(OUT0)
N$48: LD2.20(IREF) RL2.P$2
N$49: LD2.19(SOUT) LD3.23(SIN)
N$50: LD3.20(IREF) RL3.P$2
N$51: L3.P$2(2-N) LD3.3(OUT1)
N$52: L3.P$3(3-M) LD3.4(OUT2)
N$53: L3.P$4(4-L) LD3.5(OUT3)
N$54: L3.P$5(5-DP) LD3.6(OUT4)
N$55: L3.P$6(6-C) LD3.7(OUT5)
N$56: L3.P$7(7-D) LD3.8(OUT6)
N$57: L3.P$8(8-E) LD3.9(OUT7)
N$58: L3.P$9(9-G) LD3.10(OUT8)
N$59: L3.P$10(10-A) LD3.11(OUT9)
N$60: L3.P$11(11-B) LD3.12(OUT10)
N$61: L3.P$12(12-K) LD3.13(OUT11)
N$62: L3.P$13(13-J) LD3.14(OUT12)
N$63: L3.P$15(15-H) LD3.15(OUT13)
N$64: L3.P$16(16-F) LD3.16(OUT14)
N$65: L2.P$1(1-P) LD2.2(OUT0)
N$66: L2.P$2(2-N) LD2.3(OUT1)
N$67: L2.P$3(3-M) LD2.4(OUT2)
N$68: L2.P$4(4-L) LD2.5(OUT3)
N$69: L2.P$5(5-DP) LD2.6(OUT4)
N$70: L2.P$6(6-C) LD2.7(OUT5)
N$71: L2.P$7(7-D) LD2.8(OUT6)
N$72: L2.P$8(8-E) LD2.9(OUT7)
N$73: L2.P$9(9-G) LD2.10(OUT8)
N$74: L2.P$10(10-A) LD2.11(OUT9)
N$75: L2.P$11(11-B) LD2.12(OUT10)
N$76: L2.P$12(12-K) LD2.13(OUT11)
N$77: L2.P$13(13-J) LD2.14(OUT12)
N$78: L2.P$15(15-H) LD2.15(OUT13)
N$79: L2.P$16(16-F) LD2.16(OUT14)
N$80: L1.P$1(1-P) LD1.2(OUT0)
N$81: L1.P$2(2-N) LD1.3(OUT1)
N$82: L1.P$3(3-M) LD1.4(OUT2)
N$83: L1.P$4(4-L) LD1.5(OUT3)
N$84: L1.P$5(5-DP) LD1.6(OUT4)
N$85: L1.P$6(6-C) LD1.7(OUT5)
N$86: L1.P$7(7-D) LD1.8(OUT6)
N$87: L1.P$8(8-E) LD1.9(OUT7)
N$88: L1.P$9(9-G) LD1.10(OUT8)
N$89: L1.P$10(10-A) LD1.11(OUT9)
N$90: L1.P$11(11-B) LD1.12(OUT10)
N$91: L1.P$12(12-K) LD1.13(OUT11)
N$92: L1.P$13(13-J) LD1.14(OUT12)
N$93: L1.P$15(15-H) LD1.15(OUT13)
N$94: L1.P$16(16-F) LD1.16(OUT14)
WS2812BIN: RN1.P$2 ; also sheet 1
Unconnected: LD1.17(OUT15) LD2.17(OUT15) LD3.17(OUT15)

### Notes on the sheet
- OUTPUTS/LEDS
- NEOPIXELS (N)
- These are MSL-6! Bake before reflow!
- ALPHANUMERICS (L) | IDIOT LIGHT | POWER LED
- *Mapping each bit to each display segment (and then
  to each letter) in software is necessary to use these.

## Library data of the parts
2+16X2 = MF_Connectors:CON_01X18: Library: MF_Connectors Description: Header Connector with 18 Positions and 01 Rows. Use the LABEL Attribute to label the pin on the schematic and PCB. You can remove the attributes on the PCB by using the SMASH function on the part and then deleting the text.; HOUSEPART: YES; MPN: MF-CON-2.54mm-01x18; POPULATE: 1; URL: https://factory.macrofab.com/part/MF-CON-2.54mm-01x18
3.3V-5V-LLS = SparkFun-IC-Comms:TXB0108: 8-Bit Bi-Directional Level Shifter 1.2V-3.6V (VCCA) to 1.65V-5.5V (VCCB) bi-directional level shifter with auto direction sensing. Max data rate - VCCA 1.2V: 20Mbps (50ns), VCCA 3.3V: 100Mbps (10ns) Digikey: 296-27217-1-ND (20-UFDFN) SparkFun Products SparkFun GPS Logger Shield <https://www.sparkfun.com/products/13750> (GPS-13750) SparkFun Block for Intel® Edison - microSD <https://www.sparkfun.com/products/13041> (DEV-13041) SparkFun Block for Intel® Edison - Dual H-Bridge <https://www.sparkfun.com/products/13043> (DEV-13043) SparkFun Block for Intel® Edison - GPIO <https://www.sparkfun.com/products/13038> (DEV-13038) SparkFun Block for Intel® Edison - Raspberry Pi B <https://www.sparkfun.com/products/13044> (DEV-13044); PROD_ID: IC-12292
5V-3.3V = linear:MCP1703*: 250 mA, 16V, Low Quiescent Current LDO Regulator Source: http://ww1.microchip.com/downloads/en/DeviceDoc/22049b.pdf
5WAY = ClintonLib:ALPS-SKRHAAE010
12VPTCZ = ClintonLib:LITTELFUSE-POLYZEN-ZEN164V130A24LS
15VTVS = ClintonLib:LITTELFUSE-TPSMA6L15A
16MHZ_328P 16MHZ_M2560 16MHZCAN = CSTCE16M0V53-R0:CSTCE16M0V53-R0: 16MHz Ceramic Resonator Built in Capacitor 15pF ±0.3% -20°C ~ 80°C Surface Mount; AVAILABILITY: Good; DESCRIPTION: Ceramic Resonator 16MHz ??0.5% (Tol) ??0.3% (Stability) 15pF 40Ohm 3-Pin CSMD T/R; MF: Murata; MP: CSTCE16M0V53-R0; PACKAGE: None; PRICE: 0.30 USD
328P = Atmel_By_element14_Batch_1-00:ATMEGA328P-MU: Programmable Flash; MPN: ATMEGA328P-MU; OC_FARNELL: 1748522; OC_NEWARK: 26R2526; PACKAGE: QFN-32; SUPPLIER: Atmel
ACT1 ACT2 CHECK_ENGINE = MF_LEDs:LED_SINGLE: Library: MF_LEDs Description: Device for Single LED Packages. Manufacture part number (MFG#) can be added via Attributes.; HOUSEPART: YES; MPN: MF-LED-0603-RED; POPULATE: 1; URL: https://factory.macrofab.com/part/MF-LED-0603-RED
BNO = ClintonLib:BOSCH-BNO055
BOSCHILLATOR = SparkFun-Clocks:CRYSTAL: Crystals (Generic) These are passive quartz crystals, which can be used as a clock source for a microcontroller. Crystal's are two-terminal devices. They require external "load" capacitors to generate an oscillating signal.
BSS-SCL BSS-SDA = MF_Discrete_Semiconductor:N-CHANNEL_FET: Library: MF_Discrete_Semiconductor Description: Device for Single N-Channel Mosfet. Manufacture part number (MFG#) can be added via Attributes.; HOUSEPART: YES; MPN: MF-DSC-SOT233-BSS138; POPULATE: 1; URL: https://factory.macrofab.com/part/MF-DSC-SOT233-BSS138
C3V1-C3V3 CB1-CB4 CC1-CC6 CE1-CE10 CL1-CL3 CM1-CM5 CMR1 CN1-CN10 CP1-CP5 CPR1 CR1 CR_DBNC = MF_Passives:CAPACITOR_NP: Library: MF_Passives Description: Device for Non-Polarized Capacitors. Manufacture part number (MPN) can be added via Attributes. Check https://factory.macrofab.com/parts for the house parts list.; POPULATE: 1
CAN_TVS = diode:PESD1CAN: CAN bus ESD protection diode Source: http://www.nxp.com/documents/data_sheet/PESD1CAN.pdf
CR1216/12MM = SparkFun-Batteries:BATTERY: Battery - Single Cell A variety of battery chemistries, sizes, and footprints. Device List: 20MM_PTH - Coin Cell Battery Holder - 20mm (PTH) <https://www.sparkfun.com/products/783> 12MM_SMD - Coin Cell Battery Holder - 12mm (SMD) <https://www.sparkfun.com/products/10592> 12MM_PTH - Coin Cell Battery Holder - 12mm (PTH) <https://www.sparkfun.com/products/7948> 20MM_SMD - 20mm Coin Cell Battery Holder (SMD) (2 legs) Used on the Big Time Watch Kit <https://www.sparkfun.com/products/11734> 20MM_SMD_4LEGS - Coin Cell Battery Holder - 20mm (SMD) <https://www.sparkfun.com/products/11892> 20MM_SMD_4LEGS_OVERPASTE - Coin Cell Battery Holder - 20mm (SMD) <https://www.sparkfun.com/products/11892> (Over-paste on the legs) 24.5MM_PTH - Coin Cell Battery Holder - 24.5mm (PTH) <https://www.sparkfun.com/products/8863> 9V - 9V Battery Holder - PC Mount Used on the SparkFun SparkPunk Sound Kit <https://www.sparkfun.com/products/11177> and SparkFun SparkPunk Sequencer Kit <https://www.sparkfun.com/products/12707> 18650 - Battery Holder - 18650 (PTH) <https://www.sparkfun.com/products/13113> AA - Battery Holder - 1xAA (PTH) <https://www.sparkfun.com/products/7949> AAA - Battery Holder - 1xAAA (PTH) <https://www.sparkfun.com/products/12718> AA_KIT - Battery Holder - 1xAA (PTH) <https://www.sparkfun.com/products/7949> Special kit package - pads only have exposed copper on one side of the board. AAA_KIT - Battery Holder - 1xAAA (PTH) <https://www.sparkfun.com/products/12718> Special kit package - pads only have exposed copper on one side of the board.; PROD_ID: BATT-08044; SF_SKU: PRT-10592
D1 = MF_Discrete_Semiconductor:DIODES: Library: MF_Discrete_Semiconductor Description: Device for Single Packaged Diodes.; HOUSEPART: YES; MPN: MF-DIO-SOD123-1N4148; POPULATE: 1; URL: https://factory.macrofab.com/part/MF-DIO-SOD123-1N4148
FID1-FID3 = MF_Aesthetics:FIDUCIAL: Library: MF_Aesthetics Description: Fiducial marking for PCB alignment inside PNP and other machines.; HOUSEPART: NO; POPULATE: 0
ILINR1 ILINR2 R7 RB1-RB7 RCAN1-RCAN4 RL1-RL3 RMA RN1 RN2 RPA RPWR RR1 RR2 RSCL RSDA = MF_Passives:RESISTOR: Library: MF_Passives Description: Device for Resistors. Manufacture part number (MPN), Voltage, Tolerance, and Wattage Rating can be added via Attributes. Check https://factory.macrofab.com/parts for the house parts list.; POPULATE: 1
ISP1 ISP2 = adafruit:AVRISP: AVR ISP HEADER Standard 6 pin header for AVR programming
JP2 = SparkFun-Jumpers:JUMPER-SMT_2_NO: Normally open jumper This jumper has two pads in close proximity to each other. Apply solder to close the connection. Round pads are easier to solder for beginners, but are a lot larger. SparkFun Product that uses the round pads: SparkFun EL Sequencer <https://www.sparkfun.com/products/12781>
L1-L3 = ClintonLib:ACPSA04-41SYKWA
LD1-LD3 = Texas Instruments_By_element14_Batch_1:TLC59281RGER: 16-Channel, Constant-Current LED Driver; MPN: TLC59281RGER; OC_FARNELL: -; OC_NEWARK: 72R6575; PACKAGE: VQFN-24; SUPPLIER: Texas Instruments
LED1-LED20 = MF_LEDs:WS2812B: Manufacturer Part #: WS2812B Manufacturer: WorldSemi Description: RGB LED with Intergrated Control Driver RGB; HOUSEPART: NO; MPN: WS2812B; POPULATE: 1; URL: https://cdn-shop.adafruit.com/datasheets/WS2812B.pdf
M2515 = MCP2515_MT:MCP2515*: MCP2515 Standalone CAN-Controller by Microchip Eagle-Lib. by MartinThomas
M2551 = MCP2551-I_SN:MCP2551-I/SN: High-Speed CAN Transceiver; AVAILABILITY: Good; DESCRIPTION: MCP2551 Series 5.5 V 1 Mb/s Surface Mount High-Speed CAN Transceiver - SOIC-8; MF: Microchip; MP: MCP2551-I/SN; PACKAGE: SOIC-8 Microchip; PRICE: 0.93 USD
M2560 = Atmel_By_element14_Batch_1-00:ATMEGA2560-16AU: Microcontroller; DESCRIPTION: Microcontroller; MPN: ATMEGA2560-16AU; OC_FARNELL: 1288330; OC_NEWARK: 23M5051; PACKAGE: LQFP-100; SUPPLIER: ATMEL
OVPD1 OVPD2 = MF_Discrete_Semiconductor:DIODES: Library: MF_Discrete_Semiconductor Description: Device for Single Packaged Diodes.; HOUSEPART: NO; POPULATE: 1
PWR = MF_LEDs:LED_SINGLE: Library: MF_LEDs Description: Device for Single LED Packages. Manufacture part number (MFG#) can be added via Attributes.; HOUSEPART: YES; MPN: MF-LED-0603-GREEN; POPULATE: 1; URL: https://factory.macrofab.com/part/MF-LED-0603-GREEN
RLEDPOT = MF_Passives:POTENTIOMETER: Library: MF_Passives Description: Device for Potentiometers. Manufacture part number (MPN) can be added via Attributes. Check https://factory.macrofab.com/parts for the house parts list.; HOUSEPART: YES; MPN: MF-RES-TC33X-10K; POPULATE: 1; TOLERANCE: 25%; URL: https://factory.macrofab.com/part/MF-RES-TC33X-10K; WATTAGE: 100mW
RST1 RST2 = MF_Switches:TACT: Library: MF_Switches Description: Device for Tact Switches. Manufacture part number (MFG#) can be added via Attributes.; HOUSEPART: YES; MPN: MF-SW-TACT-4.2MM; POPULATE: 1; URL: https://factory.macrofab.com/part/MF-SW-TACT-4.2MM
RTC = SparkFun-Clocks:DS3231M: DS3231M Real Time Clock Accuracy +/-5ppm. Battery Backup. 2.3V to 5.5V. Datasheet <https://cdn.sparkfun.com/datasheets/Dev/Beagle/DS3231M.pdf> SparkFun Products CryptoCape <https://www.sparkfun.com/products/12773> (DEV-12773) SparkFun CryptoShield <https://www.sparkfun.com/products/13183> (DEV-13183); PROD_ID: IC-11985
SPM1-12V-5V = ClintonLib:SPM1004-5V0C: Sumida SPM1004-5V0C Non-Isolated SMD/SMT DC/DC Converter 12V-5V 6A LGA-73 15mm x 9mm x 3mm http://www.mouser.com/ProductDetail/Sumida/SPM1004-5V0C http://www.mouser.com/ds/2/390/SPM1004_Datasheet_V3.3-922924.pdf
TERMINATE = SparkFun-Passives:JUMPER-PAD-2-NO
U-SD = SparkFun-Connectors:USD-SOCKET: microSD Socket Push-push type uSD socket. Schematic element and footprint production proven. Spark Fun Electronics SKU : PRT-00127. tDoc lines correctly indicate media card edge positions when inserting (unlocked, locked, depressed). NOTE: CD1 and CD2 are connected internally; PROD_ID: CONN-07820
X2 = con-phoenix-254:MPT8: PHOENIX CONNECTOR; OC_FARNELL: unknown; OC_NEWARK: unknown
ZE = Diodes_Inc_By_element14_Batch_1:BZX84C5V6: 350mW SURFACE MOUNT ZENER DIODE; MPN: BZX84C5V6; OC_FARNELL: 1902459; OC_NEWARK: 55T1793; PACKAGE: SOT-23-3; SUPPLIER: DIODES INC.

## Net classes
0 default: width 0.254 mm, drill 0.305 mm, clearance 0.064 mm
1 _12mil: width 0.305 mm, clearance 0.127 mm
2 _25mil: width 0.635 mm, clearance 0.127 mm
3 5mil: width 0.127 mm, clearance 0.127 mm
4 10mil: width 0.254 mm, clearance 0.254 mm
5 8mil: width 0.203 mm, drill 0.305 mm, clearance 0.064 mm